# Altium schematic sheet DC_Volt_Sense.SchDoc
size A4; SheetNumber: 9; SheetTotal: 13
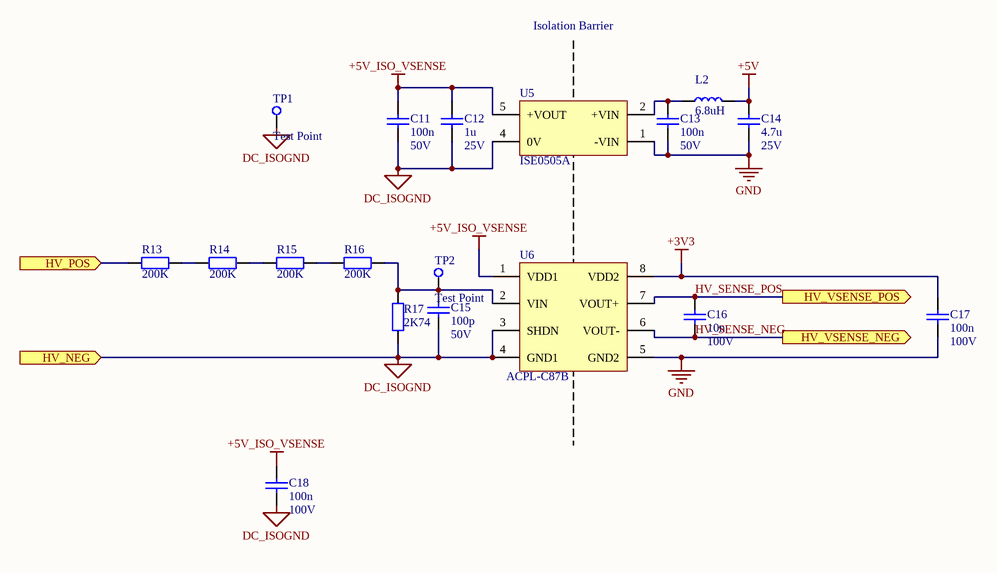
[diagram p0: DC_Volt_Sense.SchDoc]

## Parts
C11  100n  Voltage - Rated: 50V  [CAP 0603/1608]
C12  1u  Voltage - Rated: 25V  [CAP 0603/1608]
C13  100n  Voltage - Rated: 50V  [CAP 0603/1608]
C14  4.7u  Voltage - Rated: 25V  [CAP 0603/1608]
C15  100p  Voltage - Rated: 50V  [CAP 0603/1608]
C16  10n  Voltage - Rated: 100V  [CAP 0603/1608]
C17  100n  Voltage - Rated: 100V  [CAP 0805/2012 - 1.4MM]
C18  100n  Voltage - Rated: 100V  [CAP 0805/2012 - 1.4MM]
L2  6.8uH  [1210L]
R13  200K  [RES 1206/3216]
R14  200K  [RES 1206/3216]
R15  200K  [RES 1206/3216]
R16  200K  [RES 1206/3216]
R17  2K74  [RES 1206/3216]
TP1  Test Point  [RCT-0C]
TP2  Test Point  [RCT-0C]
U5  ISE0505A  [XP ISE 8-SMD]
U6  ACPL-C87B  [Broadcom SSO-8]

## Ports
HV_NEG (in), HV_POS (in), HV_VSENSE_NEG (out), HV_VSENSE_POS (out)

## Nets
+3V3: C17.2 U6.8(VDD2)
+5V: C14.2 L2.1
+5V_ISO_VSENSE: C11.2 C12.2 C18.2 U5.5(+VOUT) U6.1(VDD1)
DC_ISOGND: C11.1 C12.1 C15.1 C18.1 R17.1 TP1.1(TP) U5.4(0V) U6.3(SHDN) U6.4(GND1) ; port HV_NEG
GND: C13.2 C14.1 C17.1 U5.1(-VIN) U6.5(GND2)
HV_POS: R13.1 ; port HV_POS
HV_SENSE_NEG: C16.1 U6.6(VOUT-) ; port HV_VSENSE_NEG
HV_SENSE_POS: C16.2 U6.7(VOUT+) ; port HV_VSENSE_POS
NetC13_1: C13.1 L2.2 U5.2(+VIN)
NetC15_2: C15.2 R16.2 R17.2 TP2.1(TP) U6.2(VIN)
NetR13_2: R13.2 R14.1
NetR14_2: R14.2 R15.1
NetR15_2: R15.2 R16.1

## Notes on the sheet
- Isolation Barrier

## Library data of the parts
C11 C13 = GCM188R71H104KA57D: CAP CER 0.1UF 50V X7R 0603; Manufacturer: Murata Electronics North America; Package Imperial: 0603; Package Metric: 1608; Value: 100n; Part Number: GCM188R71H104KA57D; Digi-Key Part Number: 490-4779-1-ND
C12 = CL10B105KA8NNNC: CAP CER 1UF 25V X7R 0603; Manufacturer: Samsung Electro-Mechanics; Package Imperial: 0603; Package Metric: 1608; Tolerance: 0.1; Value: 1u; Part Number: CL10B105KA8NNNC; Dielectric: X7R; Digi-Key Part Number: 1276-1184-1-ND
C14 = GRM188C81E475KE11D: CAP CER 4.7UF 25V X6S 0603; Manufacturer: Murata Electronics North America; Package Imperial: 0603; Package Metric: 1608; Tolerance: 0.1; Value: 4.7u; Part Number: GRM188C81E475KE11D; Dielectric: X6S; Digi-Key Part Number: 490-7199-1-ND
C15 = C0603C101J5GACTU: CAP CER 100PF 50V C0G/NP0 0603; Manufacturer: KEMET; Package Imperial: 0603; Package Metric: 1608; Tolerance: 0.05; Value: 100p; Part Number: C0603C101J5GACTU; Dielectric: C0G/NP0; Digi-Key Part Number: 399-1061-1-ND
C16 = GCM188R72A103KA37D: CAP CER 10000PF 100V X7R 0603; Manufacturer: Murata Electronics North America; Package Imperial: 0603; Package Metric: 1608; Value: 10n; Part Number: GCM188R72A103KA37D; Digi-Key Part Number: 490-4781-1-ND
C17 C18 = GCM21BR72A104KA37L: CAP CER 0.1UF 100V X7R 0805; Manufacturer: Murata Electronics North America; Package Imperial: 0805; Package Metric: 2012; Tolerance: 0.1; Value: 100n; Part Number: GCM21BR72A104KA37L; Dielectric: X7R; Digi-Key Part Number: 490-4789-1-ND
L2 = TFM322512ALMA6R8MTAA: Part Number: MLZ2012N6R8LTD25; Manufacturer: TDK Corporation; Maximun Temperature: 150; Minimum Temperature: -55; inventory_price: 1.44; Digi-Key Part Number: 445-16384-1-ND; partnumber: TFM322512ALMA6R8MTAA; Manufacturer Part Number: TDK Corporation; URL Datasheet: https://product.tdk.com/info/en/catalog/datasheets/inductor_automotive_power_tfm322512alma_en.pdf?ref_disty=digikey; Digikey PN: 445-TFM322512ALMA6R8MTAACT-ND; parttype: Fixed Inductor
R13-R16 = RC1206FR-07200KL: RES SMD 200K OHM 1% 1/4W 1206; Manufacturer: Yageo; Package Imperial: 1206; Package Metric: 3216; Temperature Coefficient: ±100ppm/°C; Power (Watts): 0.25W, 1/4W; Part Number: RC1206FR-07200KL; Value: 200K; Tolerance: ±1%; Digi-Key Part Number: 311-200KFRCT-ND
R17 = RC1206FR-072K74L: RES SMD 2.74K OHM 1% 1/4W 1206; Manufacturer: Yageo; Package Imperial: 1206; Package Metric: 3216; Temperature Coefficient: ±100ppm/°C; Power (Watts): 0.25W, 1/4W; Part Number: RC1206FR-072K74L; Value: 2K74; Tolerance: ±1%; Digi-Key Part Number: 311-2.74KFRCT-ND
TP1 TP2 = RCT-0C: 0805 PROBE PAD; Part Number: RCT-0C; Digi-Key Part Number: A106144CT-ND
U5 = ISE0505A: Isolated Module DC DC Converter 1 Output 5V 200mA 4.5V - 5.5V Input; Manufacturer: XP Power; Part Number: ISE0505A; Digi-Key Part Number: 1470-2945-1-ND
U6 = ACPL-C87B: Isolation Amplifier 1 Circuit Differential 8-SO; Manufacturer: Broadcom; Part Number: ACPL-C87B; Manufacturer Part Number: ACPL-C87B; Digi-Key Part Number: 516-2579-5-ND